# EAGLE schematic symbol_reference (EAGLE 7.1.0)
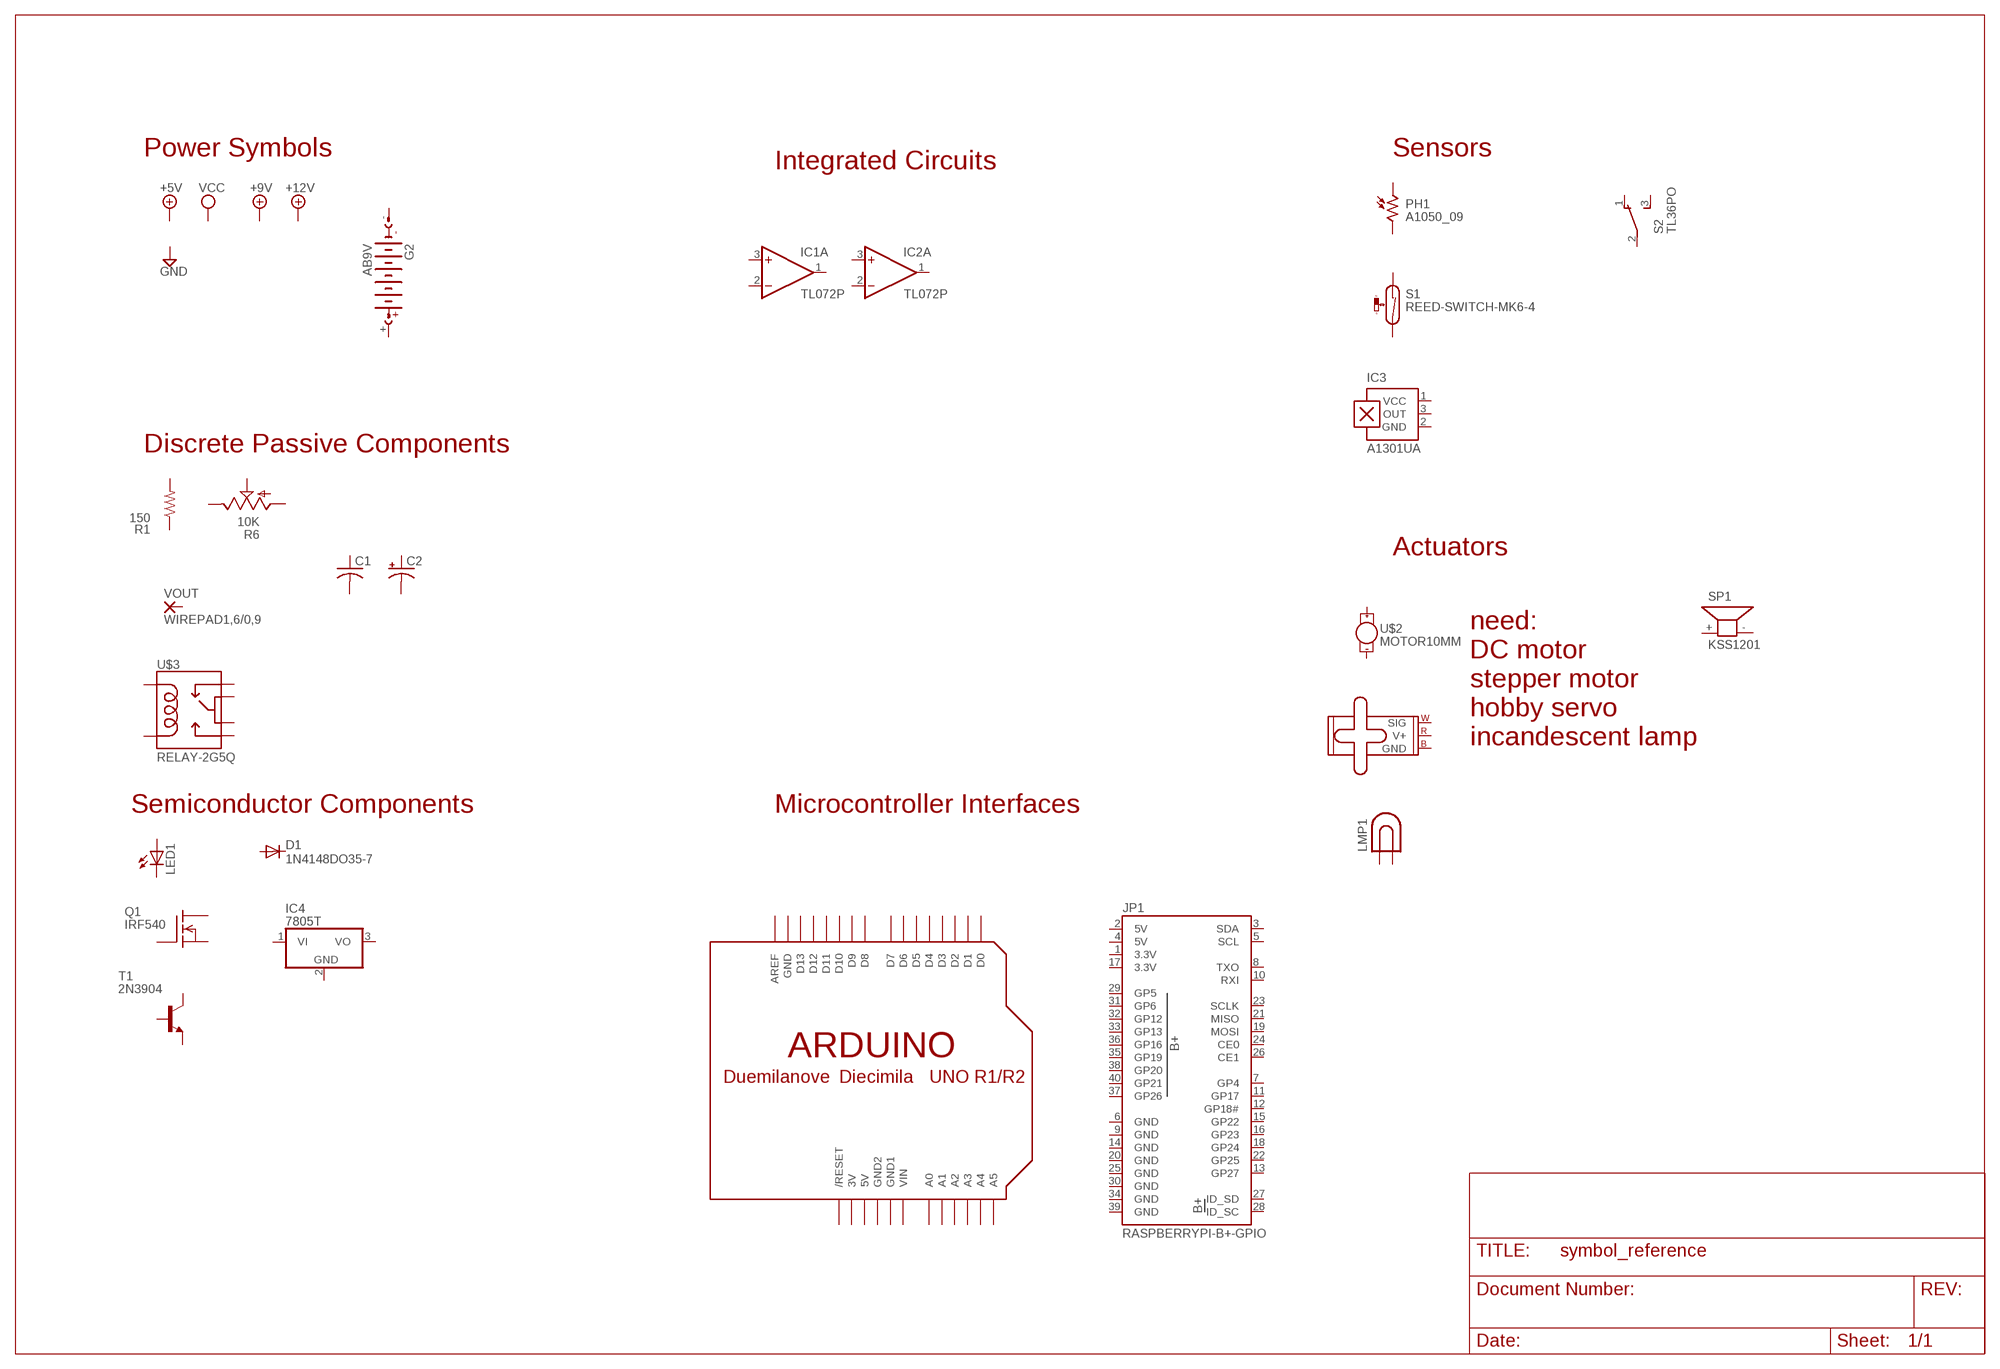
[diagram p0: schematic, sheet 1]

## Parts
C1  C-US025-030X050  [C025-030X050]
C2  CPOL-USE2.5-6  [E2,5-6]
D1  1N4148DO35-7  [DO35-7]
G2  AB9V  [AB9V]
IC1  TL072P  [DIL08]
IC2  TL072P  [DIL08]
IC3  A1301UA  [SIP3-UA]
IC4  7805T  [TO220H]
JP1  RASPBERRYPI-B+-GPIO  [2X20-SHROUDED]
LED1  LED10MM  [LED10MM]
LMP1  LAMP  [LDH-5R]
M1  SMALL_SERVO  [1X03]
PH1  A1050_09  [T0-46-A10XX]
Q1  IRF540  [TO220]
R1  150  R-US_0204/7  [0204/7]
R6  10K  TRIM_US-B25V  [B25V]
S1  REED-SWITCH-MK6-4  [MK6-4]
S2  TL36PO  [TL3XPO]
SP1  KSS1201  [KSS1201]
T1  2N3904  [TO92]
U$1  ARDUINOUNO  [ARDUINO]
U$2  MOTOR10MM  [VIBE-MOTOR-10MM]
U$3  RELAY-2G5Q  [RELAY-G5V]
VOUT  WIREPAD1,6/0,9  [1,6/0,9]
Unconnected: C1.1 C1.2 C2.+ C2.- D1.A D1.C G2.+ G2.- IC1.1(A:OUT) IC1.2(A:-IN) IC1.3(A:+IN) IC1.5(B:+IN) IC1.6(B:-IN) IC1.7(B:OUT) IC2.1(A:OUT) IC2.2(A:-IN) IC2.3(A:+IN) IC2.5(B:+IN) IC2.6(B:-IN) IC2.7(B:OUT) IC3.3(OUT) IC4.1(VI) IC4.2(GND) IC4.3(VO) JP1.3(SDA) JP1.5(SCL) JP1.7(GP4) JP1.8(TXO) JP1.10(RXI) JP1.11(GP17) JP1.12(GP18#) JP1.13(GP27) JP1.15(GP22) JP1.16(GP23) JP1.18(GP24) JP1.19(MOSI) JP1.21(MISO) JP1.22(GP25) JP1.23(SCLK) JP1.24(CE0) JP1.26(CE1) JP1.27(ID_SD) JP1.28(ID_SC) JP1.29(GP5) JP1.31(GP6) JP1.32(GP12) JP1.33(GP13) JP1.35(GP19) JP1.36(GP16) JP1.37(GP26) JP1.38(GP20) JP1.40(GP21) LED1.A LED1.K(C) LMP1.1 LMP1.2 M1.1(SIG) M1.2(V+) M1.3(GND) PH1.1 PH1.2 Q1.1(G) Q1.2(D) Q1.3(S) R1.1 R1.2 R6.A R6.E R6.S S1.1 S1.2 S2.1(O) S2.2(P) S2.3(S) SP1.+ SP1.- T1.1(C) T1.2(B) T1.3(E) U$1.A0 U$1.A1 U$1.A2 U$1.A3 U$1.A4 U$1.A5 U$1.AREF U$1.D0 U$1.D1 U$1.D2 U$1.D3 U$1.D4 U$1.D5 U$1.D6 U$1.D7 U$1.D8 U$1.D9 U$1.D10 U$1.D11 U$1.D12 U$1.D13 U$1.RESET(/RESET) U$2.+ U$2.- U$3.1 U$3.2 U$3.5 U$3.6 U$3.9 U$3.10 VOUT.1(P)

## Notes on the sheet
- Power Symbols | Sensors
- Integrated Circuits
- Discrete Passive Components
- Actuators
- need:
  DC motor
  stepper motor
  hobby servo
  incandescent lamp
- Semiconductor Components | Microcontroller Interfaces

## Power pins joined to a net without a drawn wire
3.3V: JP1.1(3.3V) JP1.17(3.3V)
3V: U$1.3V
5V: JP1.2(5V) JP1.4(5V) U$1.5V
GND: IC3.2(GND) JP1.6(GND) JP1.9(GND) JP1.14(GND) JP1.20(GND) JP1.25(GND) JP1.30(GND) JP1.34(GND) JP1.39(GND) U$1.GND
GND1: U$1.GND1
GND2: U$1.GND2
V+: IC1.8(P:V+) IC2.8(P:V+)
V-: IC1.4(P:V-) IC2.4(P:V-)
VCC: IC3.1(VCC)
VIN: U$1.VIN

## Library data of the parts
C1 = resistor:C-US: CAPACITOR, American symbol
C2 = resistor:CPOL-US: POLARIZED CAPACITOR, American symbol
D1 = diode:1N4148: DIODE high speed (Philips)
G2 = battery:AB9V: 9-V BATTERY CLIP
IC1 IC2 = linear:TL072: OP AMP
IC3 = allegro:A13*?: Linear Hall Effect Sensor ICs Continuous-Time Ratiometric High-Temperature Operation Programmable Linear with Analog Output A1302 -Replacement- UGN3503 Source: http://www.allegromicro.com/en/Products/Part_Numbers/1301/1301.pdf http://www.allegromicro.com/en/Products/Part_Numbers/1321/1321.pdf http://www.allegromicro.com/en/Products/Part_Numbers/1381/1381.pdf; MF: ALLEGRO MICROSYSTEMS, INC.; MPN: A1301EUA-T; OC_FARNELL: 1198085; OC_NEWARK: 31K6635
IC4 = linear:78*: Positive VOLTAGE REGULATOR Source: http://cache.national.com/ds/LM/LM78L05.pdf http://www.fairchildsemi.com/ds/LM/LM7805.pdf
JP1 = SparkFun-Boards:RASPBERRYPI-B+-GPIO: Raspberry Pi B+ GPIO Header 2x20 pin connector
LED1 = led:LED: LED OSRAM: - CHIPLED LG R971, LG N971, LY N971, LG Q971, LY Q971, LO R971, LY R971 LH N974, LH R974 LS Q976, LO Q976, LY Q976 LO Q996 - Hyper CHIPLED LW Q18S LB Q993, LB Q99A, LB R99A - SideLED LS A670, LO A670, LY A670, LG A670, LP A670 LB A673, LV A673, LT A673, LW A673 LH A674 LY A675 LS A676, LA A676, LO A676, LY A676, LW A676 LS A679, LY A679, LG A679 - Hyper Micro SIDELED® LS Y876, LA Y876, LO Y876, LY Y876 LT Y87S - SmartLED LW L88C, LW L88S LB L89C, LB L89S, LG L890 LS L89K, LO L89K, LY L89K LS L896, LA L896, LO L896, LY L896 - TOPLED LS T670, LO T670, LY T670, LG T670, LP T670 LSG T670, LSP T670, LSY T670, LOP T670, LYG T670 LG T671, LOG T671, LSG T671 LB T673, LV T673, LT T673, LW T673 LH T674 LS T676, LA T676, LO T676, LY T676, LB T676, LH T676, LSB T676, LW T676 LB T67C, LV T67C, LT T67C, LS T67K, LO T67K, LY T67K, LW E67C LS E67B, LA E67B, LO E67B, LY E67B, LB E67C, LV E67C, LT E67C LW T67C LS T679, LY T679, LG T679 LS T770, LO T770, LY T770, LG T770, LP T770 LB T773, LV T773, LT T773, LW T773 LH T774 LS E675, LA E675, LY E675, LS T675 LS T776, LA T776, LO T776, LY T776, LB T776 LHGB T686 LT T68C, LB T68C - Hyper Mini TOPLED® LB M676 - Mini TOPLED Santana® LG M470 LS M47K, LO M47K, LY M47K Source: http://www.osram.convergy.de LUXEON: - LUMILED® LXK2-PW12-R00, LXK2-PW12-S00, LXK2-PW14-U00, LXK2-PW14-V00 LXK2-PM12-R00, LXK2-PM12-S00, LXK2-PM14-U00 LXK2-PE12-Q00, LXK2-PE12-R00, LXK2-PE12-S00, LXK2-PE14-T00, LXK2-PE14-U00 LXK2-PB12-K00, LXK2-PB12-L00, LXK2-PB12-M00, LXK2-PB14-N00, LXK2-PB14-P00, LXK2-PB14-Q00 LXK2-PR12-L00, LXK2-PR12-M00, LXK2-PR14-Q00, LXK2-PR14-R00 LXK2-PD12-Q00, LXK2-PD12-R00, LXK2-PD12-S00 LXK2-PH12-R00, LXK2-PH12-S00 LXK2-PL12-P00, LXK2-PL12-Q00, LXK2-PL12-R00 Source: www.luxeon.com KINGBRIGHT: KA-3528ASYC Source: www.kingbright.com
LMP1 = special:LAMP: LED HOLDER
M1 = SparkFun-Electromechanical:SMALL_SERVO: Small servo motor This is the small servo used in the SIK. SKU: ROB-09065
PH1 = photo-elements:A10: Sensor Robust Light Sensing Applications Outdoor Light Sensing Application Source: http://optoelectronics.perkinelmer.com/content/Datasheets/DTS_PhotocellsA1050.pdf
Q1 = transistor-fet:IRF540: N-Channel Enhancement MOSFET (HEXFET); 100V; 28A; 0,077Ohm
R1 = resistor:R-US_: RESISTOR, American symbol
R6 = pot:TRIM_US-: POTENTIOMETER
S1 = switch-reed:REED-SWITCH-: Reed Sensor; OC_FARNELL: unknown
S2 = switch:TL36PO: TINY SWITCH ON - ON Source: http://www2.produktinfo.conrad.com/datenblaetter/700000-724999/705152-da-01-de-Subminiaturschalter_TL_36YO.pdf
SP1 = buzzer:KSS1201: SPEAKER Source: Schukat; OC_FARNELL: unknown; OC_NEWARK: unknown
T1 = transistor:2N3904: NPN TRANSISTOR
U$1 = adafruit:ARDUINO: Arduino Diecimila/Duemilanove Make a shield with ease, this package has all the named pins as well as the two mounting drill holes and an outline of the USB and DC power connector. The outline is on the DIMENSION layer, so if your board house uses it they will cut the outline to match. http://www.ladyada.net/library/pcb/eaglelibrary.html
U$2 = SparkFun-Electromechanical:MOTOR: Vibration Motor- ROB-08449 Physical dimension and wire connections for this powerful vibration motor. Motor has a self adhesive backing.
U$3 = SparkFun-Electromechanical:RELAY-2: SPDT relay (COM-00100)
VOUT = wirepad:WIREPAD: Wire PAD connect wire on PCB